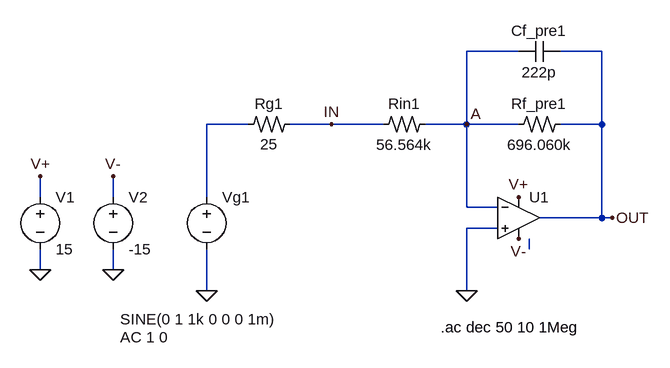
[diagram p0: schematic PreAmp_frequency.asc]
PreAmp_frequency.asc, the LTspice schematic file:
Version 4
SHEET 1 880 680
WIRE 320 -64 240 -64
WIRE 448 -64 384 -64
WIRE -96 48 -160 48
WIRE 32 48 -32 48
WIRE 112 48 32 48
WIRE 240 48 240 -64
WIRE 240 48 176 48
WIRE 320 48 240 48
WIRE 448 48 448 -64
WIRE 448 48 384 48
WIRE -416 160 -416 128
WIRE -304 160 -304 128
WIRE -160 160 -160 48
WIRE 240 176 240 48
WIRE 288 176 240 176
WIRE 448 192 448 48
WIRE 448 192 352 192
WIRE 464 192 448 192
WIRE 288 208 240 208
WIRE 336 240 336 224
WIRE -416 272 -416 240
WIRE -304 272 -304 240
WIRE -160 304 -160 240
WIRE 240 304 240 208
FLAG -416 272 0
FLAG -304 272 0
FLAG -416 128 V+
FLAG -304 128 V-
FLAG 240 304 0
FLAG 464 192 OUT
FLAG 32 48 IN
FLAG 320 224 V-
FLAG 320 160 V+
FLAG -160 304 0
FLAG 240 48 A
SYMBOL voltage -416 144 R0
WINDOW 123 24 126 Left 2
WINDOW 39 24 111 Left 2
SYMATTR InstName V1
SYMATTR Value 15
SYMBOL voltage -304 144 R0
WINDOW 123 24 126 Left 2
WINDOW 39 24 111 Left 2
SYMATTR InstName V2
SYMATTR Value -15
SYMBOL Opamps/UniversalOpamp2 320 192 R0
SYMATTR InstName U1
SYMBOL res2 176 32 R90
WINDOW 0 0 32 VBottom 2
WINDOW 3 32 32 VTop 2
SYMATTR InstName Rin1
SYMATTR Value 56.564k
SYMBOL res2 384 32 R90
WINDOW 0 0 32 VBottom 2
WINDOW 3 32 32 VTop 2
SYMATTR InstName Rf_pre1
SYMATTR Value 696.060k
SYMBOL res2 -32 32 R90
WINDOW 0 0 32 VBottom 2
WINDOW 3 31 32 VTop 2
SYMATTR InstName Rg1
SYMATTR Value 25
SYMBOL voltage -160 144 R0
WINDOW 3 -133 204 Left 2
WINDOW 123 -133 232 Left 2
WINDOW 39 0 0 Left 0
SYMATTR Value SINE(0 1 1k 0 0 0 1m)
SYMATTR Value2 AC 1 0
SYMATTR InstName Vg1
SYMBOL cap 384 -80 R90
WINDOW 0 0 32 VBottom 2
WINDOW 3 32 32 VTop 2
SYMATTR InstName Cf_pre1
SYMATTR Value 222p
TEXT 200 360 Left 2 !.ac dec 50 10 1Meg

The netlist it stands for:
* PreAmp_frequency.asc
V1 V+ 0 15
V2 V- 0 -15
XU1 0 A V+ V- OUT level.2 Avol=1Meg GBW=10Meg Slew=10Meg ilimit=25m rail=0 Vos=0 phimargin=45 en=0 enk=0 in=0 ink=0 Rin=500Meg  ; pins IN+ IN- V+ V- OUT
Rin1 A IN 56.564k
Rf_pre1 OUT A 696.060k
Rg1 IN N001 25
Vg1 N001 0 SINE(0 1 1k 0 0 0 1m) AC 1 0
Cf_pre1 OUT A 222p
.ac dec 50 10 1Meg
.lib UniversalOpamps2.sub
.backanno
.end